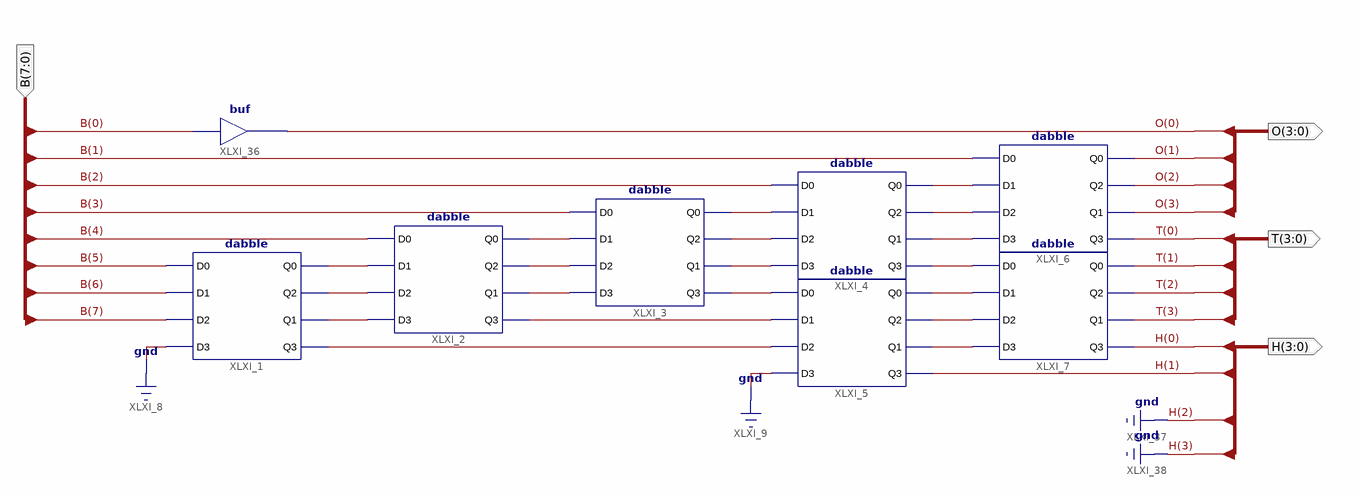
[diagram p0: schematic sheet 1]
// Xilinx ISE schematic dd8b.sch (spartan6) as structural Verilog: 8 symbols, 4 ports
module dd8b (
  input  [7:0] B,
  output [3:0] O,
  output [3:0] T,
  output [3:0] H
);

  wire XLXN_2, XLXN_3, XLXN_4, XLXN_5, XLXN_6, XLXN_7, XLXN_8, XLXN_9, XLXN_10, XLXN_12, XLXN_13, XLXN_14,
       XLXN_15, XLXN_16, XLXN_17, XLXN_18, XLXN_19, XLXN_20, XLXN_22;

  dabble XLXI_6 (.D0(B[1]), .D1(XLXN_22), .D2(XLXN_20), .D3(XLXN_19), .Q0(O[1]), .Q1(O[3]), .Q2(O[2]), .Q3(T[0]));
  dabble XLXI_7 (.D0(XLXN_18), .D1(XLXN_17), .D2(XLXN_16), .D3(XLXN_15), .Q0(T[1]), .Q1(T[3]), .Q2(T[2]), .Q3(H[0]));
  dabble XLXI_5 (
    .D0(XLXN_12), .D1(XLXN_13), .D2(XLXN_14), .D3(1'b0), .Q0(XLXN_17), .Q1(XLXN_15), .Q2(XLXN_16), .Q3(H[1]));
  dabble XLXI_4 (
    .D0(B[2]), .D1(XLXN_8), .D2(XLXN_9), .D3(XLXN_10), .Q0(XLXN_22), .Q1(XLXN_19), .Q2(XLXN_20), .Q3(XLXN_18));
  dabble XLXI_3 (
    .D0(B[3]), .D1(XLXN_7), .D2(XLXN_6), .D3(XLXN_5), .Q0(XLXN_8), .Q1(XLXN_10), .Q2(XLXN_9), .Q3(XLXN_12));
  dabble XLXI_2 (.D0(B[4]), .D1(XLXN_2), .D2(XLXN_3), .D3(XLXN_4), .Q0(XLXN_7), .Q1(XLXN_5), .Q2(XLXN_6), .Q3(XLXN_13));
  dabble XLXI_1 (.D0(B[5]), .D1(B[6]), .D2(B[7]), .D3(1'b0), .Q0(XLXN_2), .Q1(XLXN_4), .Q2(XLXN_3), .Q3(XLXN_14));
  buf XLXI_36 (O[0], B[0]);

  assign H[3:2] = 2'b00;
endmodule
